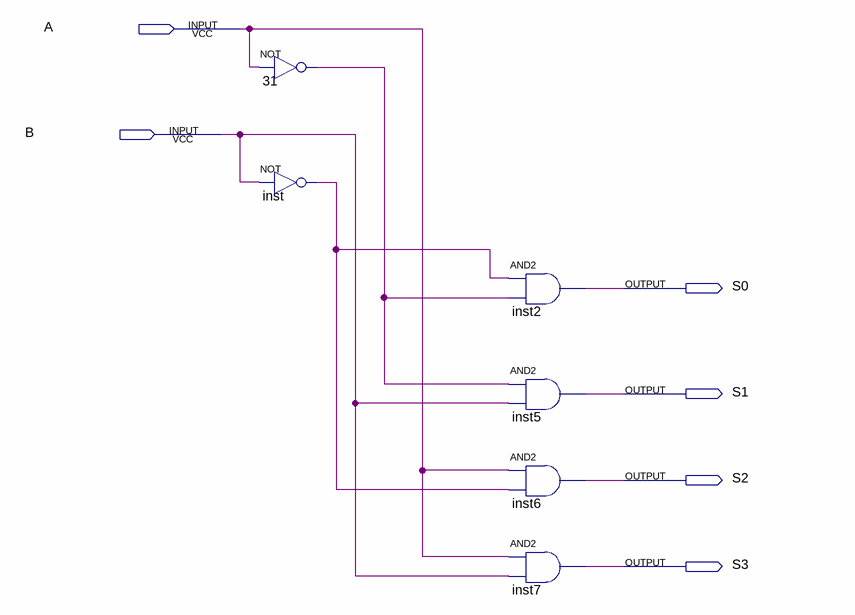
[diagram p0: schematic sheet]
// Quartus schematic decoder2_4.bdf as structural Verilog: 6 symbols, 6 pins
module decoder2_4 (
  input  A,
  input  B,
  output S0,
  output S1,
  output S2,
  output S3
);

  wire inst_out, n31_out;

  not u_31 (n31_out, A);
  not inst (inst_out, B);
  and inst2 (S0, inst_out, n31_out);
  and inst5 (S1, n31_out, B);
  and inst6 (S2, A, inst_out);
  and inst7 (S3, A, B);
endmodule
